# Altium schematic sheet SPI_ROM.SchDoc
size A4; SheetNumber: 10; SheetTotal: 11
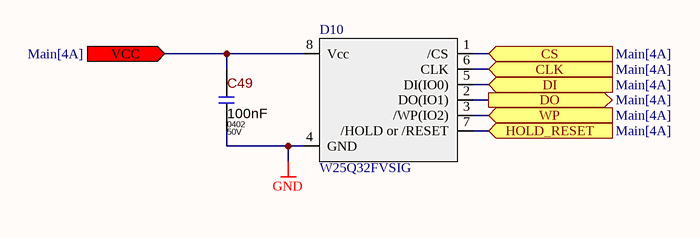
[diagram p0: SPI_ROM.SchDoc]

## Parts
C49  Package: 0402  Voltage: 50V  [Cap_0402]  (hidden comment: 100nF)
D10  W25Q32FVSIG  [SOIC8]

## Ports
CLK (in, see Main[4A]), CS (in, see Main[4A]), DI (in, see Main[4A]), DO (out, see Main[4A]), HOLD_RESET (in, see Main[4A]), VCC (in, see Main[4A]), WP (in, see Main[4A])

## Nets
GND: C49.2 D10.4(GND)
CLK: D10.6(CLK) ; port CLK
CS: D10.1(/CS) ; port CS
DI: D10.5(DI(IO0)) ; port DI
DO: D10.2(DO(IO1)) ; port DO
HOLD_RESET: D10.7(/HOLD_or_/RESET) ; port HOLD_RESET
VCC: C49.1 D10.8(Vcc) ; port VCC
WP: D10.3(/WP(IO2)) ; port WP

## Library data of the parts
C49 = Cap_0402_100nF: 100nF 50V  ±25% 0402 Ceramic Capacitor; Component Type: SMD; Tolerance: ±25%; ComponentLink1URL: https://search.murata.co.jp/Ceramy/image/img/A01X/G101/ENG/GRM31CR60J107ME39-01.pdf; ComponentLink1Description: Datasheet; Value: 100nF
D10 = W25Q32FVSIG: SPI\QSPI Flash 4MB